# EAGLE schematic parking (EAGLE 7.2.0)
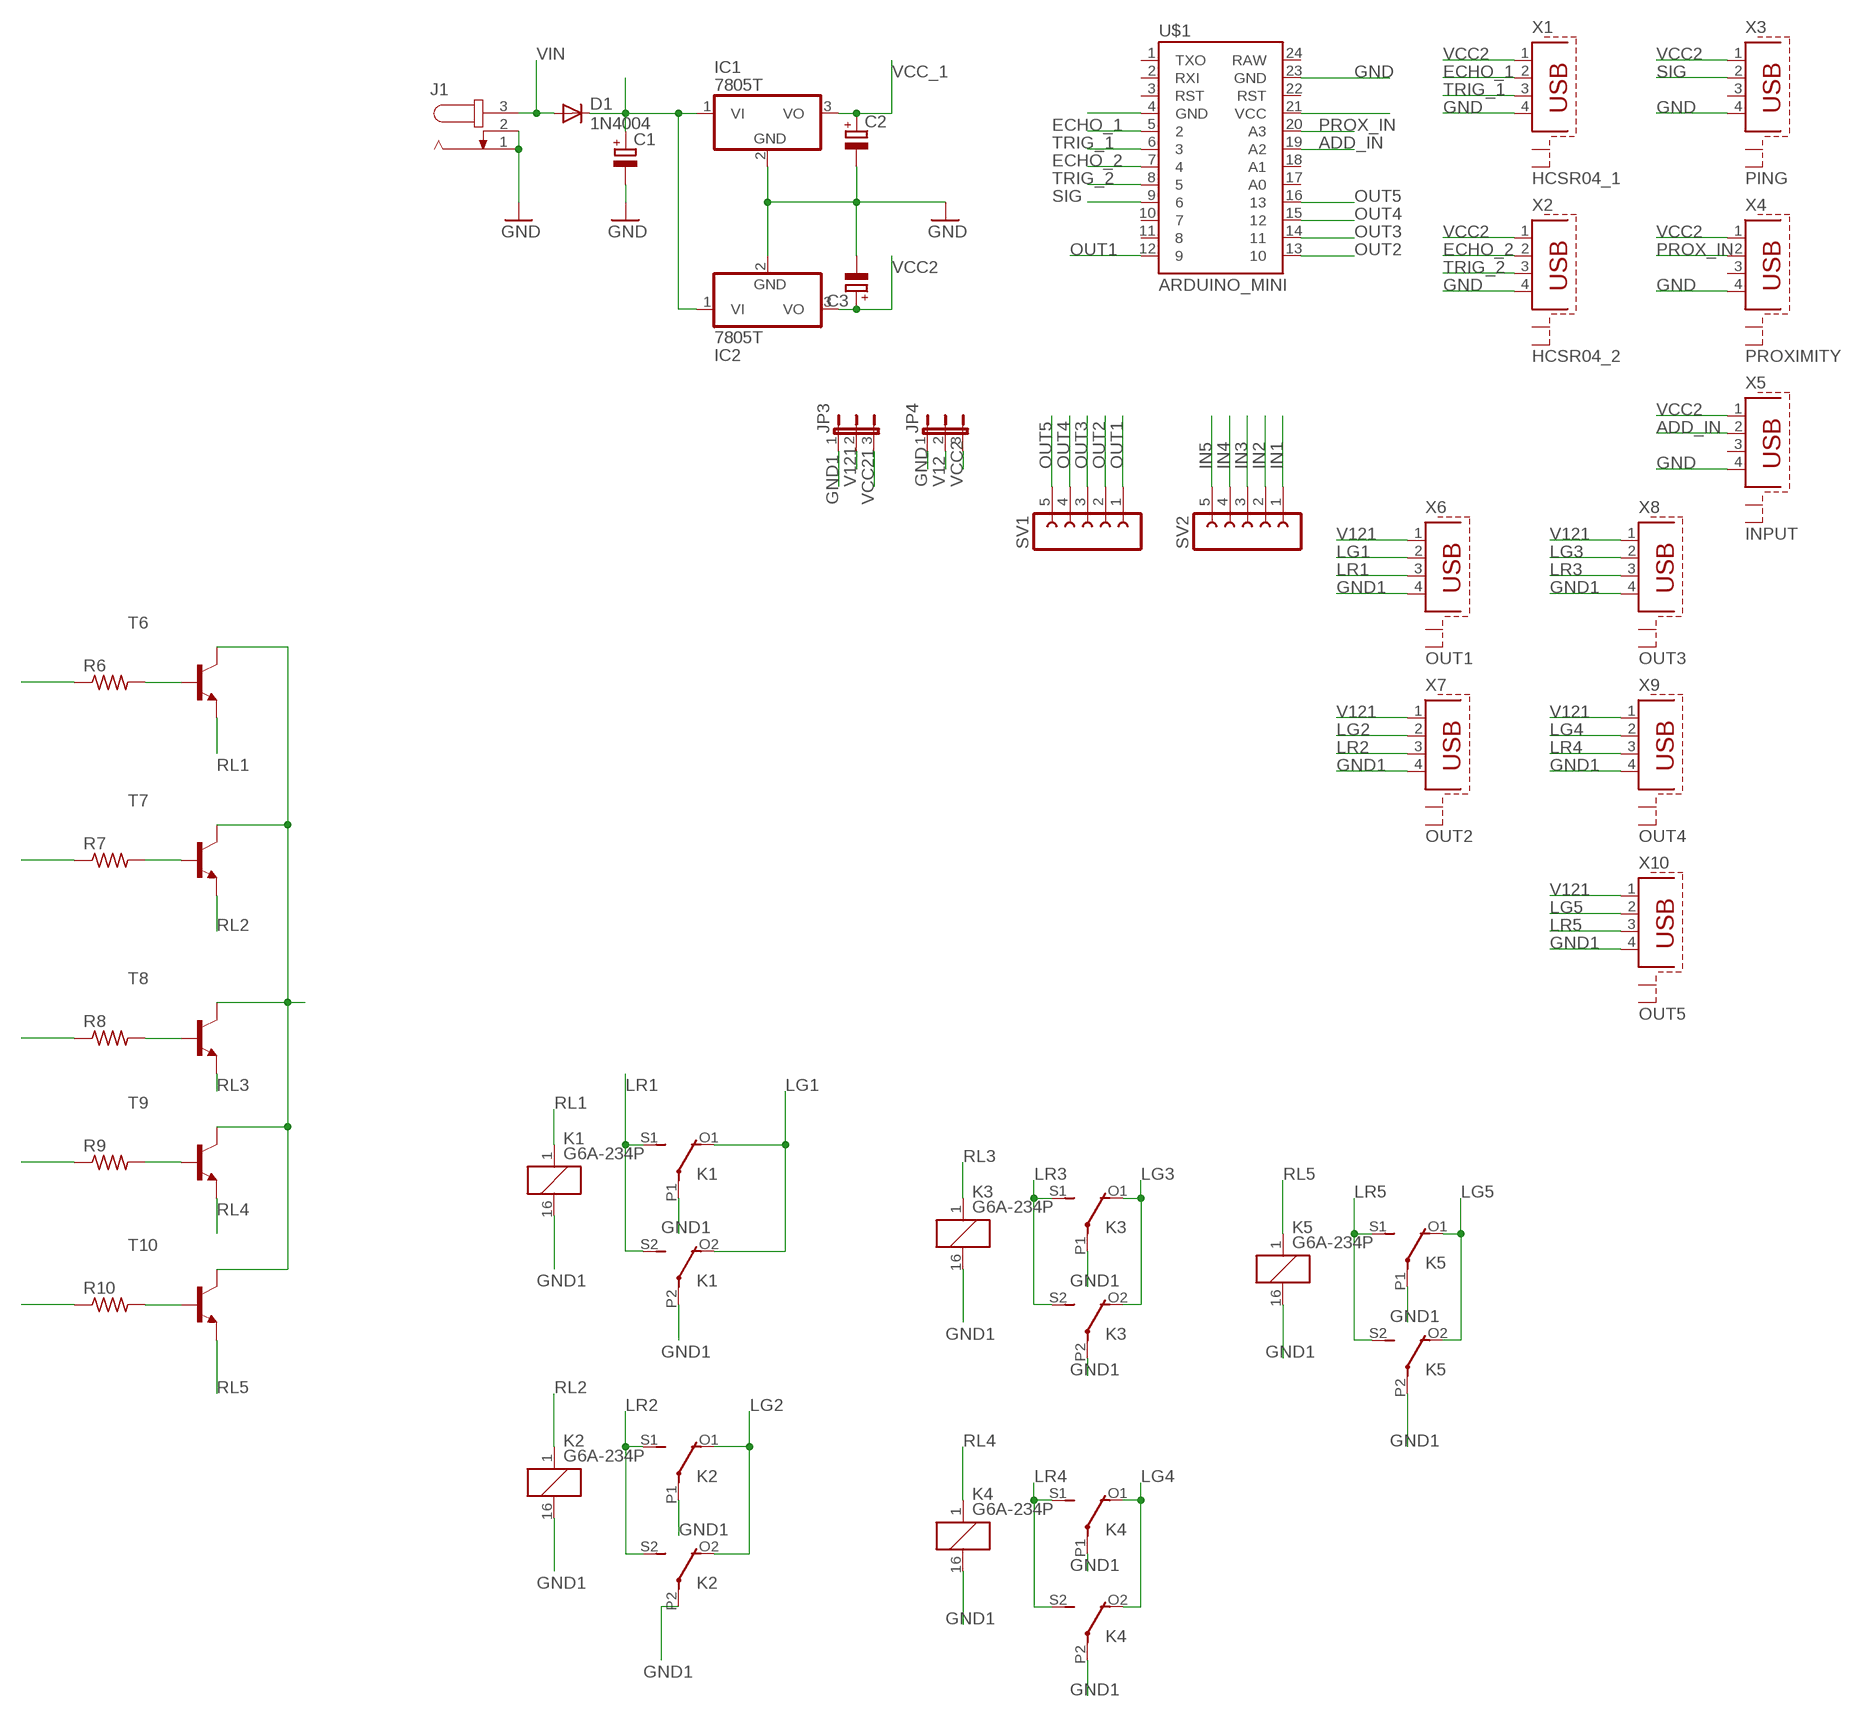
[diagram p0: schematic, sheet 1]

## Parts
C1  CPOL-EUE5-10.5  [E5-10,5]
C2  CPOL-EUE2.5-5  [E2,5-5]
C3  CPOL-EUE2.5-5  [E2,5-5]
D1  1N4004  [DO41-10]
IC1  7805T  [TO220H]
IC2  7805T  [TO220H]
J1  JACK-PLUG1  [SPC4078]
JP3  JP2E  [JP2]
JP4  JP2E  [JP2]
K1  G6A-234P  [G6A-234P]
K2  G6A-234P  [G6A-234P]
K3  G6A-234P  [G6A-234P]
K4  G6A-234P  [G6A-234P]
K5  G6A-234P  [G6A-234P]
R6  R-US_0207/7  [0207/7]
R7  R-US_0207/7  [0207/7]
R8  R-US_0207/7  [0207/7]
R9  R-US_0207/7  [0207/7]
R10  R-US_0207/7  [0207/7]
SV1  FE05-1  [FE05-1]
SV2  FE05-1  [FE05-1]
T6  BC317-NPN-TO92-EBC  [TO92-EBC]
T7  BC317-NPN-TO92-EBC  [TO92-EBC]
T8  BC317-NPN-TO92-EBC  [TO92-EBC]
T9  BC317-NPN-TO92-EBC  [TO92-EBC]
T10  BC317-NPN-TO92-EBC  [TO92-EBC]
U$1  ARDUINO_MINI  [ARDUINO_MINI]
X1  HCSR04_1  PN87520-S  [PN87520-S]
X2  HCSR04_2  PN87520-S  [PN87520-S]
X3  PING  PN87520-S  [PN87520-S]
X4  PROXIMITY  PN87520-S  [PN87520-S]
X5  INPUT  PN87520-S  [PN87520-S]
X6  OUT1  PN87520-S  [PN87520-S]
X7  OUT2  PN87520-S  [PN87520-S]
X8  OUT3  PN87520-S  [PN87520-S]
X9  OUT4  PN87520-S  [PN87520-S]
X10  OUT5  PN87520-S  [PN87520-S]

## Nets
ADD_IN: U$1.19(A2) X5.2
ECHO_1: U$1.5 X1.2
ECHO_2: U$1.7 X2.2
GND: C1.- C2.- C3.- IC1.2(GND) IC2.2(GND) J1.1 J1.2 JP4.1 U$1.4(GND) U$1.23(GND) X1.4 X2.4 X3.4 X4.4 X5.4
GND1: JP3.1 K1.16 K1.P1(2:P) K1.P2(3:P) K2.16 K2.P1(2:P) K2.P2(3:P) K3.16 K3.P1(2:P) K3.P2(3:P) K4.16 K4.P1(2:P) K4.P2(3:P) K5.16 K5.P1(2:P) K5.P2(3:P) X6.4 X7.4 X8.4 X9.4 X10.4
IN1: R6.1 SV2.1
IN2: R7.1 SV2.2
IN3: R8.1 SV2.3
IN4: R9.1 SV2.4
IN5: R10.1 SV2.5
LG1: K1.O1(2:O) K1.O2(3:O) X6.2
LG2: K2.O1(2:O) K2.O2(3:O) X7.2
LG3: K3.O1(2:O) K3.O2(3:O) X8.2
LG4: K4.O1(2:O) K4.O2(3:O) X9.2
LG5: K5.O1(2:O) K5.O2(3:O) X10.2
LR1: K1.S1(2:S) K1.S2(3:S) X6.3
LR2: K2.S1(2:S) K2.S2(3:S) X7.3
LR3: K3.S1(2:S) K3.S2(3:S) X8.3
LR4: K4.S1(2:S) K4.S2(3:S) X9.3
LR5: K5.S1(2:S) K5.S2(3:S) X10.3
N$7: R6.2 T6.B
N$8: R7.2 T7.B
N$9: R8.2 T8.B
N$10: R9.2 T9.B
N$11: R10.2 T10.B
OUT1: SV1.1 U$1.12
OUT2: SV1.2 U$1.13
OUT3: SV1.3 U$1.14
OUT4: SV1.4 U$1.15
OUT5: SV1.5 U$1.16
PROX_IN: U$1.20(A3) X4.2
RL1: K1.1 T6.E
RL2: K2.1 T7.E
RL3: K3.1 T8.E
RL4: K4.1 T9.E
RL5: K5.1 T10.E
SIG: U$1.9 X3.2
TRIG_1: U$1.6 X1.3
TRIG_2: U$1.8 X2.3
V12: C1.+ D1.C IC1.1(VI) IC2.1(VI) JP4.2
V121: JP3.2 X6.1 X7.1 X8.1 X9.1 X10.1
VCC2: C3.+ IC2.3(VO) JP4.3 X1.1 X2.1 X3.1 X4.1 X5.1
VCC21: JP3.3 T6.C T7.C T8.C T9.C T10.C
VCC_1: C2.+ IC1.3(VO) U$1.21(VCC)
VIN: D1.A J1.3
Unconnected: U$1.1(TXO) U$1.2(RXI) U$1.3(RST) U$1.10 U$1.11 U$1.17(A0) U$1.18(A1) U$1.22(RST) U$1.24(RAW) X1.S1 X1.S2 X2.S1 X2.S2 X3.3 X3.S1 X3.S2 X4.3 X4.S1 X4.S2 X5.3 X5.S1 X5.S2 X6.S1 X6.S2 X7.S1 X7.S2 X8.S1 X8.S2 X9.S1 X9.S2 X10.S1 X10.S2

## Library data of the parts
C1-C3 = rcl:CPOL-EU: POLARIZED CAPACITOR, European symbol
D1 = diode:1N4004: DIODE general purpose rectifier, 1 A
IC1 IC2 = adafruit:78*: Positive VOLTAGE REGULATOR Added bigger pads to the TO-92 package
J1 = con-jack:JACK-PLUG: DC POWER JACK Power Jack, DC, Right Angle, Through Hole, Rated 5A at 16VDC, PC Terminals Distributor: Farnell (www.Farnell.de) Drawing: 84N1161.pdf / 84N1162.pdf Manufacturer: SPC Technology (www.spctechnology.com) Type: SPC4077 / SPC 4078; OC_FARNELL: unknown; OC_NEWARK: unknown
JP3 JP4 = jumper:JP2E: JUMPER
K1-K5 = relay:G6A-234P: RELAY 2 x switch, 0.3 A/125 V AC, 1 A/30 V DC, Omron; OC_FARNELL: unknown; OC_NEWARK: unknown
R6-R10 = rcl:R-US_: RESISTOR, American symbol
SV1 SV2 = con-lsta:FE05-1: FEMALE HEADER; OC_FARNELL: unknown; OC_NEWARK: unknown
T6-T10 = transistor:*-NPN-: NPN Transistror BF959 corrected 2008.03.06
U$1 = SparkFun-Boards:ARDUINO_MINI: Arduino Pro Mini footprint
X1-X10 = con-berg:PN87520-S; OC_FARNELL: unknown; OC_NEWARK: unknown